# EAGLE board pandaLight (EAGLE 6.6.0), part 1 of 2
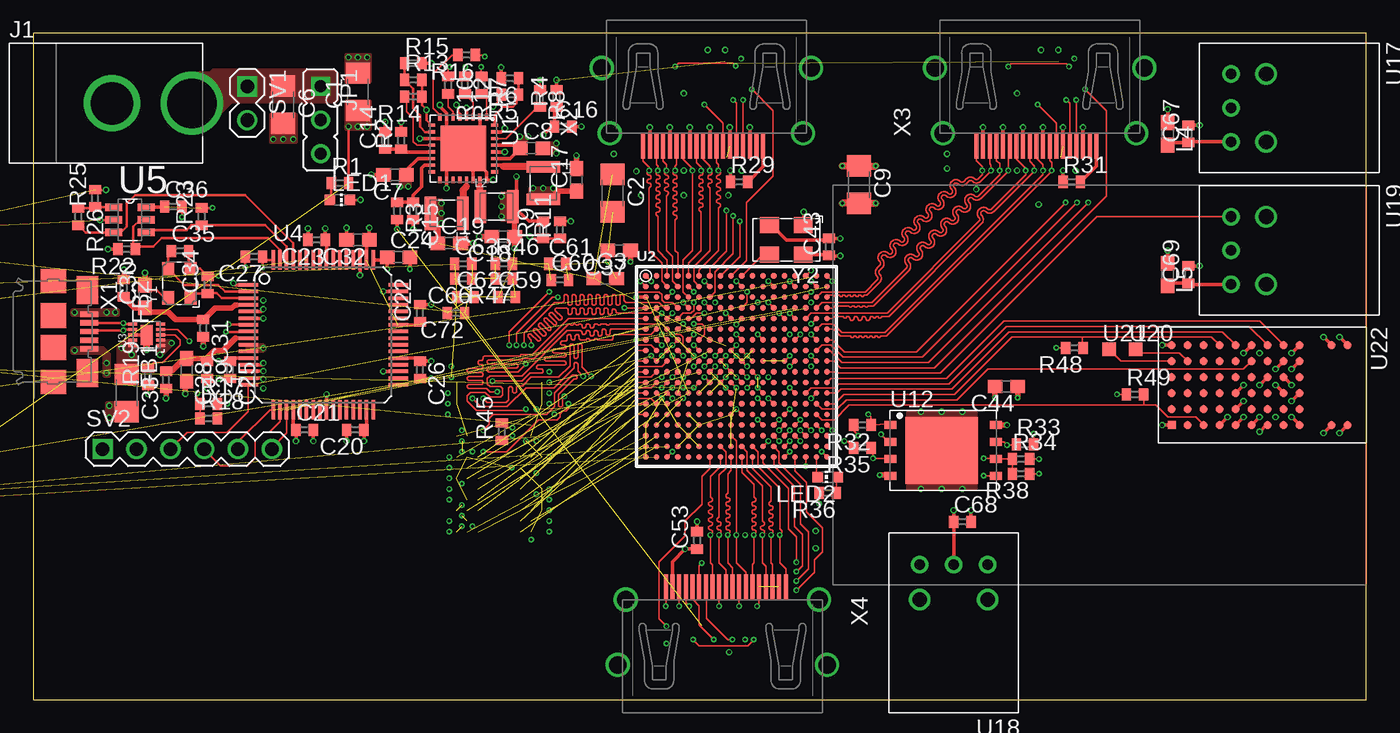
[diagram p9: board, top side]
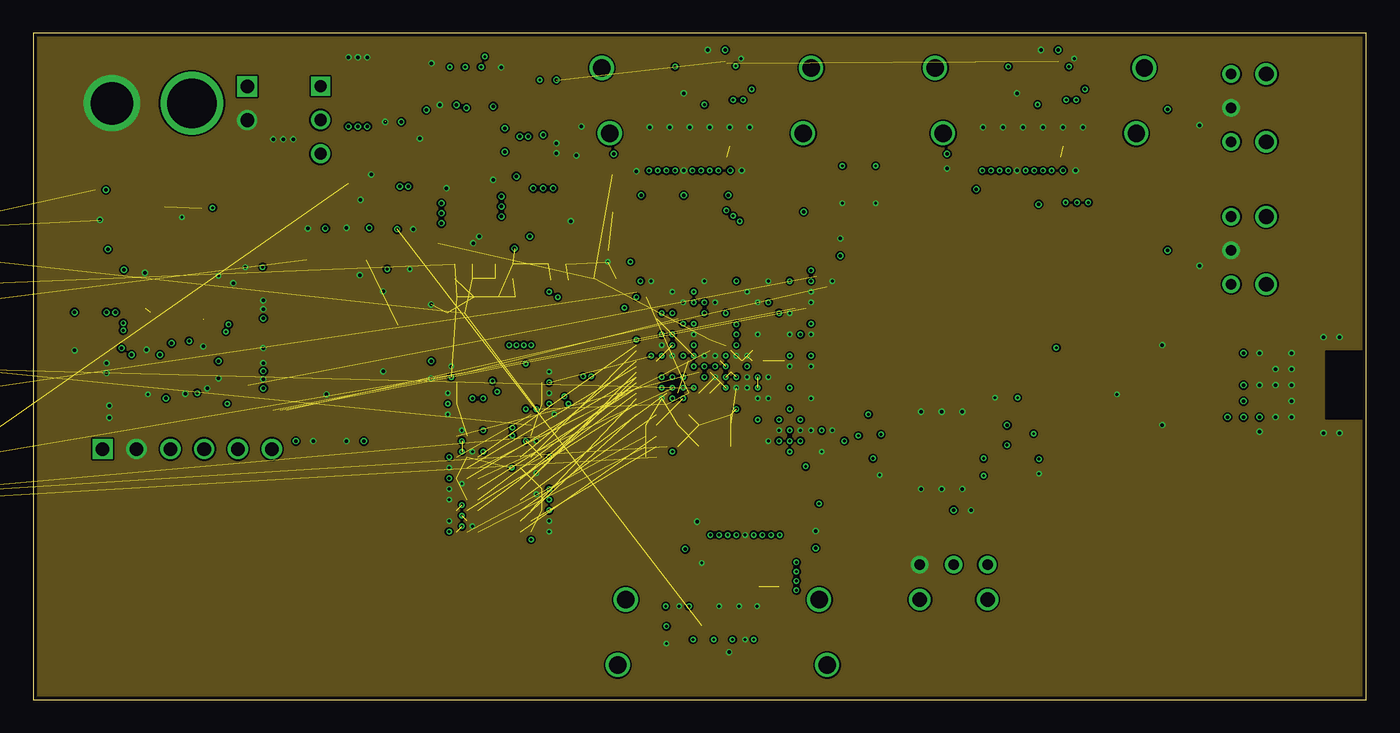
[diagram p10: board, inner layer Ground]
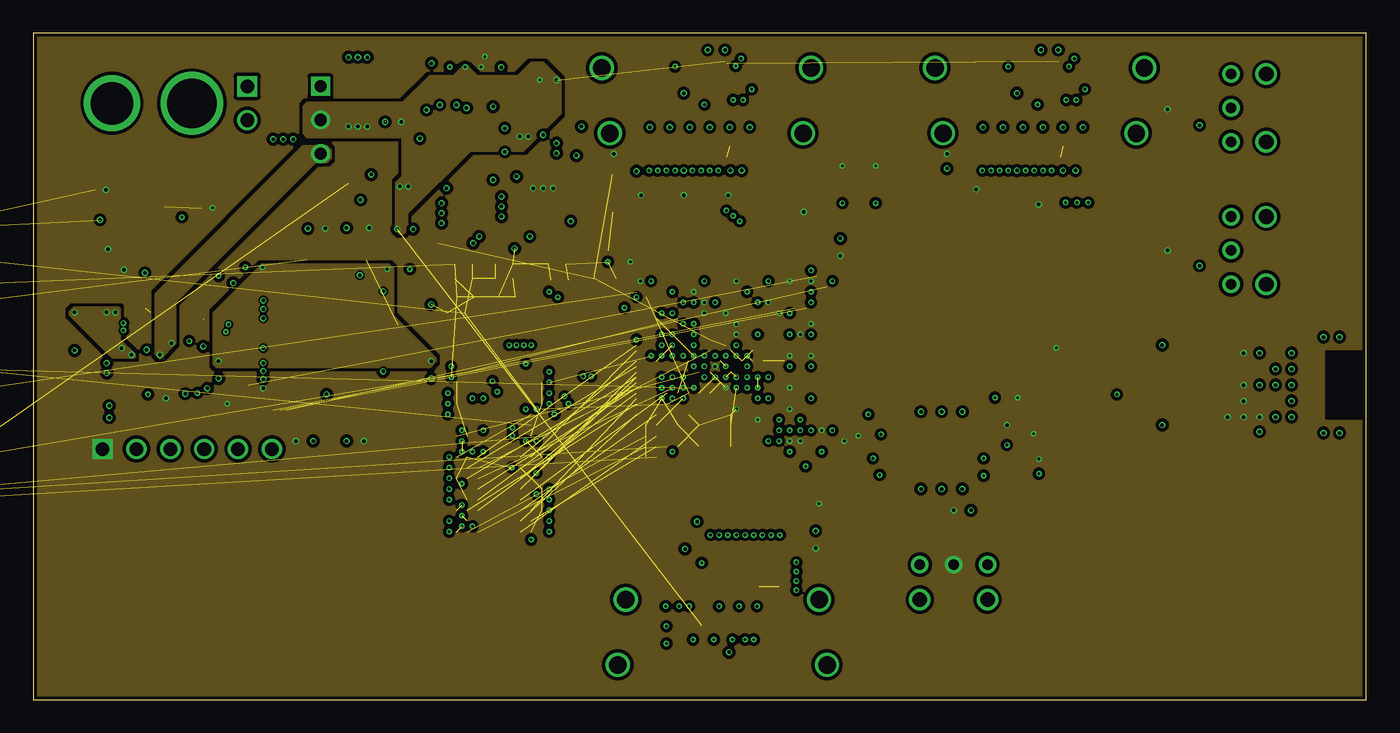
[diagram p11: board, inner layer Power]
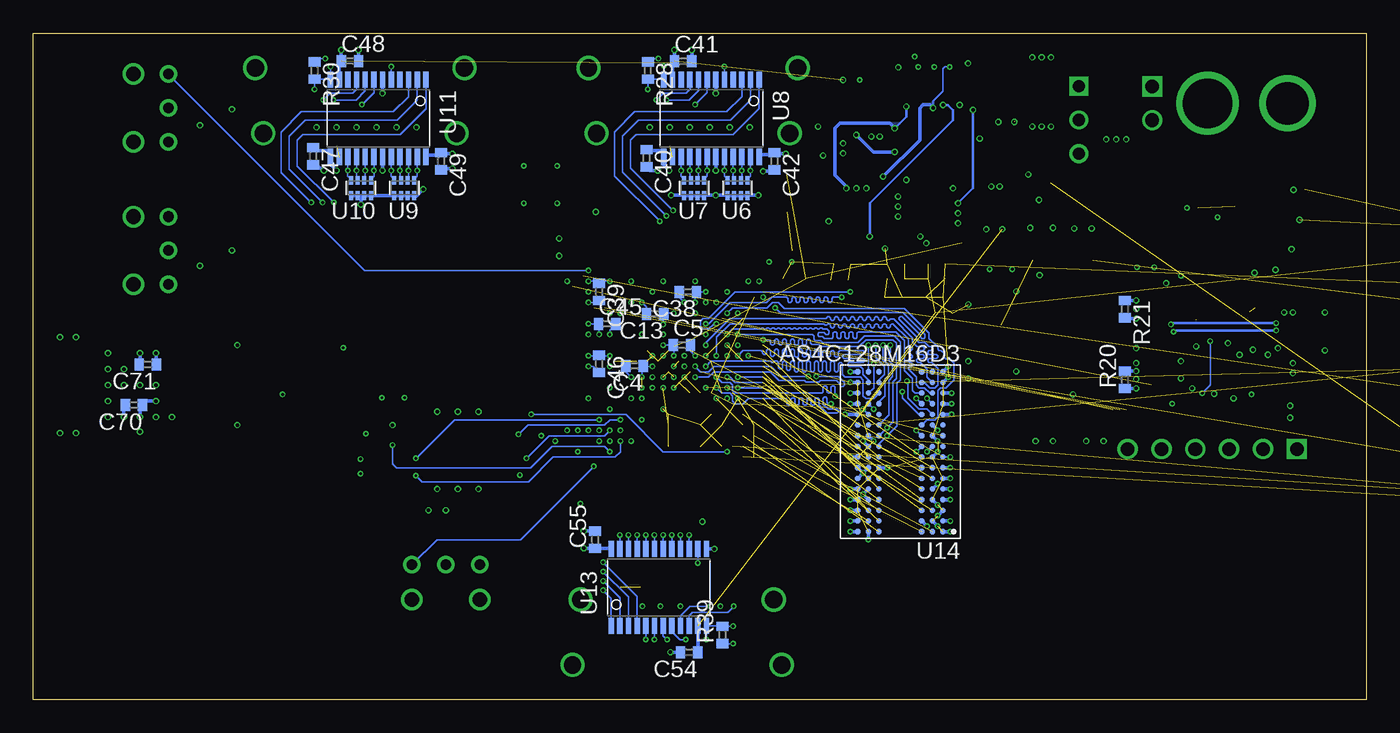
[diagram p12: board, bottom side, seen from below]

Size 100 x 50 mm. Coordinates in mm from the lower left corner, seen from the top.
Outline: 0,0 100,0 100,50 0,50 0,0
Copper layers (1*2+15*16): Top 0.035mm / dielectric 0.15mm / Ground 0.035mm / dielectric 1.16mm / Power 0.035mm / dielectric 0.15mm / Bottom 0.035mm
Design rules "rules *": minimum track width 5mil, minimum drill 8mil, track to track 5mil, track to pad 5mil, pad to pad 5mil, via to via 5mil, smd to smd 5mil, copper to edge 10mil, drill to drill 8mil, minimum pad ring 10mil, minimum via ring 4mil, stop-mask expansion 2mil, vias tented up to drill 100mil, thermal gap 10mil
Net classes: 1 power: width 0.127 mm, clearance 0.127 mm; 2 tmds: width 0.127 mm, clearance 0.127 mm; 3 ddr3_vref: width 0.127 mm, clearance 0.127 mm; 4 vbus: width 0.254 mm, clearance 0.127 mm

## Footprints (pad centres in the part's own frame; a part is rotated, then mirrored left to right if it is on the bottom)
1206 = smd 1.6 x 1.8: 1 -1.4,0; 2 1.4,0
0603 = smd 1.1 x 1: 1 -0.85,0; 2 0.85,0
0402 = smd 0.7 x 0.9: 1 -0.65,0; 2 0.65,0
PJ-037A = drill 3.2: BARREL 0,0 | drill 3.7: CENTER 6,0
JP2 = drill 0.914 square: 1 -2.54,0 | drill 0.914: 2 0,0; 3 2.54,0
1008 = smd 0.85 x 2.5: 1 -1.225,0; 2 1.225,0
LED-0603 = smd 0.8 x 0.8: A 0,-0.75; C 0,0.75
MA02-1 = drill 1.016 square: 1 -1.27,0 | drill 1.016: 2 1.27,0
MA06-1 = drill 1.016 square: 1 -6.35,0 | drill 1.016: 2 -3.81,0; 3 -1.27,0; 4 1.27,0; 5 3.81,0; 6 6.35,0
QFN-32-5X5 = smd 0.5 x 0.23: 1 -2.35,1.75; 2 -2.35,1.25; 3 -2.35,0.75; 4 -2.35,0.25; 5 -2.35,-0.25; 6 -2.35,-0.75; 7 -2.35,-1.25; 8 -2.35,-1.75; 17 2.35,-1.75; 18 2.35,-1.25; 19 2.35,-0.75; 20 2.35,-0.25; 21 2.35,0.25; 22 2.35,0.75; 23 2.35,1.25; 24 2.35,1.75 | smd 0.23 x 0.5: 9 -1.75,-2.35; 10 -1.25,-2.35; 11 -0.75,-2.35; 12 -0.25,-2.35; 13 0.25,-2.35; 14 0.75,-2.35; 15 1.25,-2.35; 16 1.75,-2.35; 25 1.75,2.35; 26 1.25,2.35; 27 0.75,2.35; 28 0.25,2.35; 29 -0.25,2.35; 30 -0.75,2.35; 31 -1.25,2.35; 32 -1.75,2.35 | smd 3.4 x 3.4: ETP 0,0
CS324 = smd 0.4 x 0.4: A1 -6.8,6.8; A2 -6,6.8; A3 -5.2,6.8; A4 -4.4,6.8; A5 -3.6,6.8; A6 -2.8,6.8; A7 -2,6.8; A8 -1.2,6.8; A9 -0.4,6.8; A10 0.4,6.8; A11 1.2,6.8; A12 2,6.8; A13 2.8,6.8; A14 3.6,6.8; A15 4.4,6.8; A16 5.2,6.8; A17 6,6.8; A18 6.8,6.8; B1 -6.8,6; B2 -6,6; B3 -5.2,6; B4 -4.4,6; B5 -3.6,6; B6 -2.8,6; B7 -2,6; B8 -1.2,6; B9 -0.4,6; B10 0.4,6; B11 1.2,6; B12 2,6; B13 2.8,6; B14 3.6,6; B15 4.4,6; B16 5.2,6; B17 6,6; B18 6.8,6; C1 -6.8,5.2; C2 -6,5.2; C3 -5.2,5.2; C4 -4.4,5.2; C5 -3.6,5.2; C6 -2.8,5.2; C7 -2,5.2; C8 -1.2,5.2; C9 -0.4,5.2; C10 0.4,5.2; C11 1.2,5.2; C12 2,5.2; C13 2.8,5.2; C14 3.6,5.2; C15 4.4,5.2; C16 5.2,5.2; C17 6,5.2; C18 6.8,5.2; D1 -6.8,4.4; D2 -6,4.4; D3 -5.2,4.4; D4 -4.4,4.4; D5 -3.6,4.4; D6 -2.8,4.4; D7 -2,4.4; D8 -1.2,4.4; D9 -0.4,4.4; D10 0.4,4.4; D11 1.2,4.4; D12 2,4.4; D13 2.8,4.4; D14 3.6,4.4; D15 4.4,4.4; D16 5.2,4.4; D17 6,4.4; D18 6.8,4.4; E1 -6.8,3.6; E2 -6,3.6; E3 -5.2,3.6; E4 -4.4,3.6; E5 -3.6,3.6; E6 -2.8,3.6; E7 -2,3.6; E8 -1.2,3.6; E9 -0.4,3.6; E10 0.4,3.6; E11 1.2,3.6; E12 2,3.6; E13 2.8,3.6; E14 3.6,3.6; E15 4.4,3.6; E16 5.2,3.6; E17 6,3.6; E18 6.8,3.6; F1 -6.8,2.8; F2 -6,2.8; F3 -5.2,2.8; F4 -4.4,2.8; F5 -3.6,2.8; F6 -2.8,2.8; F7 -2,2.8; F8 -1.2,2.8; F9 -0.4,2.8; F10 0.4,2.8; F11 1.2,2.8; F12 2,2.8; F13 2.8,2.8; F14 3.6,2.8; F15 4.4,2.8; F16 5.2,2.8; F17 6,2.8; F18 6.8,2.8; G1 -6.8,2; G2 -6,2; G3 -5.2,2; G4 -4.4,2; G5 -3.6,2; G6 -2.8,2; G7 -2,2; G8 -1.2,2; G9 -0.4,2; G10 0.4,2; G11 1.2,2; G12 2,2; G13 2.8,2; G14 3.6,2; G15 4.4,2; G16 5.2,2; G17 6,2; G18 6.8,2; H1 -6.8,1.2; H2 -6,1.2; H3 -5.2,1.2; H4 -4.4,1.2; H5 -3.6,1.2; H6 -2.8,1.2; H7 -2,1.2; H8 -1.2,1.2; H9 -0.4,1.2; H10 0.4,1.2; H11 1.2,1.2; H12 2,1.2; H13 2.8,1.2; H14 3.6,1.2; H15 4.4,1.2; H16 5.2,1.2; H17 6,1.2; H18 6.8,1.2; J1 -6.8,0.4; J2 -6,0.4; J3 -5.2,0.4; J4 -4.4,0.4; J5 -3.6,0.4; J6 -2.8,0.4; J7 -2,0.4; J8 -1.2,0.4; J9 -0.4,0.4; J10 0.4,0.4; J11 1.2,0.4; J12 2,0.4; J13 2.8,0.4; J14 3.6,0.4; J15 4.4,0.4; J16 5.2,0.4; J17 6,0.4; J18 6.8,0.4; K1 -6.8,-0.4; K2 -6,-0.4; K3 -5.2,-0.4; K4 -4.4,-0.4; K5 -3.6,-0.4; K6 -2.8,-0.4; K7 -2,-0.4; K8 -1.2,-0.4; K9 -0.4,-0.4; K10 0.4,-0.4; K11 1.2,-0.4; K12 2,-0.4; K13 2.8,-0.4; K14 3.6,-0.4; K15 4.4,-0.4; K16 5.2,-0.4; K17 6,-0.4; K18 6.8,-0.4; L1 -6.8,-1.2; L2 -6,-1.2; L3 -5.2,-1.2; L4 -4.4,-1.2; L5 -3.6,-1.2; L6 -2.8,-1.2; L7 -2,-1.2; L8 -1.2,-1.2; L9 -0.4,-1.2; L10 0.4,-1.2; L11 1.2,-1.2; L12 2,-1.2; L13 2.8,-1.2; L14 3.6,-1.2; L15 4.4,-1.2; L16 5.2,-1.2; L17 6,-1.2; L18 6.8,-1.2; M1 -6.8,-2; M2 -6,-2; M3 -5.2,-2; M4 -4.4,-2; M5 -3.6,-2; M6 -2.8,-2; M7 -2,-2; M8 -1.2,-2; M9 -0.4,-2; M10 0.4,-2; M11 1.2,-2; M12 2,-2; M13 2.8,-2; M14 3.6,-2; M15 4.4,-2; M16 5.2,-2; M17 6,-2; M18 6.8,-2; N1 -6.8,-2.8; N2 -6,-2.8; N3 -5.2,-2.8; N4 -4.4,-2.8; N5 -3.6,-2.8; N6 -2.8,-2.8; N7 -2,-2.8; N8 -1.2,-2.8; N9 -0.4,-2.8; N10 0.4,-2.8; N11 1.2,-2.8; N12 2,-2.8; N13 2.8,-2.8; N14 3.6,-2.8; N15 4.4,-2.8; N16 5.2,-2.8; N17 6,-2.8; N18 6.8,-2.8; P1 -6.8,-3.6; P2 -6,-3.6; P3 -5.2,-3.6; P4 -4.4,-3.6; P5 -3.6,-3.6; P6 -2.8,-3.6; P7 -2,-3.6; P8 -1.2,-3.6; P9 -0.4,-3.6; P10 0.4,-3.6; P11 1.2,-3.6; P12 2,-3.6; P13 2.8,-3.6; P14 3.6,-3.6; P15 4.4,-3.6; P16 5.2,-3.6; P17 6,-3.6; P18 6.8,-3.6; R1 -6.8,-4.4; R2 -6,-4.4; R3 -5.2,-4.4; R4 -4.4,-4.4; R5 -3.6,-4.4; R6 -2.8,-4.4; R7 -2,-4.4; R8 -1.2,-4.4; R9 -0.4,-4.4; R10 0.4,-4.4; R11 1.2,-4.4; R12 2,-4.4; R13 2.8,-4.4; R14 3.6,-4.4; R15 4.4,-4.4; R16 5.2,-4.4; R17 6,-4.4; R18 6.8,-4.4; T1 -6.8,-5.2; T2 -6,-5.2; T3 -5.2,-5.2; T4 -4.4,-5.2; T5 -3.6,-5.2; T6 -2.8,-5.2; T7 -2,-5.2; T8 -1.2,-5.2; T9 -0.4,-5.2; T10 0.4,-5.2; T11 1.2,-5.2; T12 2,-5.2; T13 2.8,-5.2; T14 3.6,-5.2; T15 4.4,-5.2; T16 5.2,-5.2; T17 6,-5.2; T18 6.8,-5.2; U1 -6.8,-6; U2 -6,-6; U3 -5.2,-6; U4 -4.4,-6; U5 -3.6,-6; U6 -2.8,-6; U7 -2,-6; U8 -1.2,-6; U9 -0.4,-6; U10 0.4,-6; U11 1.2,-6; U12 2,-6; U13 2.8,-6; U14 3.6,-6; U15 4.4,-6; U16 5.2,-6; U17 6,-6; U18 6.8,-6; V1 -6.8,-6.8; V2 -6,-6.8; V3 -5.2,-6.8; V4 -4.4,-6.8; V5 -3.6,-6.8; V6 -2.8,-6.8; V7 -2,-6.8; V8 -1.2,-6.8; V9 -0.4,-6.8; V10 0.4,-6.8; V11 1.2,-6.8; V12 2,-6.8; V13 2.8,-6.8; V14 3.6,-6.8; V15 4.4,-6.8; V16 5.2,-6.8; V17 6,-6.8; V18 6.8,-6.8
SON10 = smd 0.23 x 0.7: 1 -0.8,-1.05; 2 -0.4,-1.05; 3 0,-1.05; 4 0.4,-1.05; 5 0.8,-1.05; 6 0.8,1.05; 7 0.4,1.05; 8 0,1.05; 9 -0.4,1.05; 10 -0.8,1.05 | smd 1.5 x 0.9: ETP 0,0
LQFP64 = smd 1.45 x 0.27: 1 -5.625,3.75; 2 -5.625,3.25; 3 -5.625,2.75; 4 -5.625,2.25; 5 -5.625,1.75; 6 -5.625,1.25; 7 -5.625,0.75; 8 -5.625,0.25; 9 -5.625,-0.25; 10 -5.625,-0.75; 11 -5.625,-1.25; 12 -5.625,-1.75; 13 -5.625,-2.25; 14 -5.625,-2.75; 15 -5.625,-3.25; 16 -5.625,-3.75; 33 5.625,-3.75; 34 5.625,-3.25; 35 5.625,-2.75; 36 5.625,-2.25; 37 5.625,-1.75; 38 5.625,-1.25; 39 5.625,-0.75; 40 5.625,-0.25; 41 5.625,0.25; 42 5.625,0.75; 43 5.625,1.25; 44 5.625,1.75; 45 5.625,2.25; 46 5.625,2.75; 47 5.625,3.25; 48 5.625,3.75 | smd 0.27 x 1.45: 17 -3.75,-5.625; 18 -3.25,-5.625; 19 -2.75,-5.625; 20 -2.25,-5.625; 21 -1.75,-5.625; 22 -1.25,-5.625; 23 -0.75,-5.625; 24 -0.25,-5.625; 25 0.25,-5.625; 26 0.75,-5.625; 27 1.25,-5.625; 28 1.75,-5.625; 29 2.25,-5.625; 30 2.75,-5.625; 31 3.25,-5.625; 32 3.75,-5.625; 49 3.75,5.625; 50 3.25,5.625; 51 2.75,5.625; 52 2.25,5.625; 53 1.75,5.625; 54 1.25,5.625; 55 0.75,5.625; 56 0.25,5.625; 57 -0.25,5.625; 58 -0.75,5.625; 59 -1.25,5.625; 60 -1.75,5.625; 61 -2.25,5.625; 62 -2.75,5.625; 63 -3.25,5.625; 64 -3.75,5.625
SOT23-6 = smd 1.27 x 0.559: 1 -1.219,0.94; 2 -1.219,0; 3 -1.219,-0.94; 4 1.219,-0.94; 5 1.219,0; 6 1.219,0.94
741C083 = smd 0.3 x 0.65: 1 -0.75,-0.575; 2 -0.25,-0.575; 3 0.25,-0.575; 4 0.75,-0.575; 5 0.75,0.575; 6 0.25,0.575; 7 -0.25,0.575; 8 -0.75,0.575
PW_R-PDSO-G24 = smd 1.2 x 0.4: 1 -2.9,3.575; 2 -2.9,2.925; 3 -2.9,2.275; 4 -2.9,1.625; 5 -2.9,0.975; 6 -2.9,0.325; 7 -2.9,-0.325; 8 -2.9,-0.975; 9 -2.9,-1.625; 10 -2.9,-2.275; 11 -2.9,-2.925; 12 -2.9,-3.575; 13 2.9,-3.575; 14 2.9,-2.925; 15 2.9,-2.275; 16 2.9,-1.625; 17 2.9,-0.975; 18 2.9,-0.325; 19 2.9,0.325; 20 2.9,0.975; 21 2.9,1.625; 22 2.9,2.275; 23 2.9,2.925; 24 2.9,3.575
V-PDFN-8_8X6 = smd 0.9 x 0.6: 1 -3.85,1.9; 2 -3.85,0.63; 3 -3.85,-0.64; 4 -3.85,-1.91; 5 4.05,-1.9; 6 4.05,-0.63; 7 4.05,0.64; 8 4.05,1.91 | smd 5.41 x 5.05: ETP 0,0
96-FBGA_13X9 = smd 0.4 x 0.4: A1 -3.2,6; A2 -2.4,6; A3 -1.6,6; A7 1.6,6; A8 2.4,6; A9 3.2,6; B1 -3.2,5.2; B2 -2.4,5.2; B3 -1.6,5.2; B7 1.6,5.2; B8 2.4,5.2; B9 3.2,5.2; C1 -3.2,4.4; C2 -2.4,4.4; C3 -1.6,4.4; C7 1.6,4.4; C8 2.4,4.4; C9 3.2,4.4; D1 -3.2,3.6; D2 -2.4,3.6; D3 -1.6,3.6; D7 1.6,3.6; D8 2.4,3.6; D9 3.2,3.6; E1 -3.2,2.8; E2 -2.4,2.8; E3 -1.6,2.8; E7 1.6,2.8; E8 2.4,2.8; E9 3.2,2.8; F1 -3.2,2; F2 -2.4,2; F3 -1.6,2; F7 1.6,2; F8 2.4,2; F9 3.2,2; G1 -3.2,1.2; G2 -2.4,1.2; G3 -1.6,1.2; G7 1.6,1.2; G8 2.4,1.2; G9 3.2,1.2; H1 -3.2,0.4; H2 -2.4,0.4; H3 -1.6,0.4; H7 1.6,0.4; H8 2.4,0.4; H9 3.2,0.4; J1 -3.2,-0.4; J2 -2.4,-0.4; J3 -1.6,-0.4; J7 1.6,-0.4; J8 2.4,-0.4; J9 3.2,-0.4; K1 -3.2,-1.2; K2 -2.4,-1.2; K3 -1.6,-1.2; K7 1.6,-1.2; K8 2.4,-1.2; K9 3.2,-1.2; L1 -3.2,-2; L2 -2.4,-2; L3 -1.6,-2; L7 1.6,-2; L8 2.4,-2; L9 3.2,-2; M1 -3.2,-2.8; M2 -2.4,-2.8; M3 -1.6,-2.8; M7 1.6,-2.8; M8 2.4,-2.8; M9 3.2,-2.8; N1 -3.2,-3.6; N2 -2.4,-3.6; N3 -1.6,-3.6; N7 1.6,-3.6; N8 2.4,-3.6; N9 3.2,-3.6; P1 -3.2,-4.4; P2 -2.4,-4.4; P3 -1.6,-4.4; P7 1.6,-4.4; P8 2.4,-4.4; P9 3.2,-4.4; R1 -3.2,-5.2; R2 -2.4,-5.2; R3 -1.6,-5.2; R7 1.6,-5.2; R8 2.4,-5.2; R9 3.2,-5.2; T1 -3.2,-6; T2 -2.4,-6; T3 -1.6,-6; T7 1.6,-6; T8 2.4,-6; T9 3.2,-6
PMOD-2X6 = drill 1.016 square: 1 6.35,1.27 | drill 1.016: 2 3.81,1.27; 3 1.27,1.27; 4 -1.27,1.27; 5 -3.81,1.27; 6 -6.35,1.27; 7 6.35,-1.27; 8 3.81,-1.27; 9 1.27,-1.27; 10 -1.27,-1.27; 11 -3.81,-1.27; 12 -6.35,-1.27
PLR135-T10_PLT133-T10W = drill 0.8: 1 2.54,-2.63; 2 0,-2.63; 3 -2.54,-2.63 | drill 1.1: NC1 2.54,0; NC2 -2.54,0
TP10SQ = smd 1 x 1: TP 0,0
PAN1322 = smd 0.6 x 0.6: A1 3,-6.6; A2 3,-5.4; A3 3,-4.2; A4 3,-3; A5 3,-1.8; A6 3,-0.6; A7 3,0.6; A8 3,1.8; A9 3,3; A11 3,5.4; A12 3,6.6; B1 1.8,-6.6; B2 1.8,-5.4; B3 1.8,-4.2; B4 1.8,-3; B5 1.8,-1.8; B6 1.8,-0.6; B7 1.8,0.6; B8 1.8,1.8; B9 1.8,3; C1 0.6,-6.6; C2 0.6,-5.4; C3 0.6,-4.2; C4 0.6,-3; C5 0.6,-1.8; C6 0.6,-0.6; C7 0.6,0.6; C8 0.6,1.8; C9 0.6,3; D1 -0.6,-6.6; D2 -0.6,-5.4; D3 -0.6,-4.2; D4 -0.6,-3; D5 -0.6,-1.8; D6 -0.6,-0.6; D7 -0.6,0.6; D8 -0.6,1.8; D9 -0.6,3; E1 -1.8,-6.6; E2 -1.8,-5.4; E3 -1.8,-4.2; E4 -1.8,-3; E5 -1.8,-1.8; E6 -1.8,-0.6; E7 -1.8,0.6; E8 -1.8,1.8; E9 -1.8,3; F1 -3,-6.6; F2 -3,-5.4; F3 -3,-4.2; F4 -3,-3; F5 -3,-1.8; F6 -3,-0.6; F7 -3,0.6; F8 -3,1.8; F9 -3,3; F11 -3,5.4; F12 -3,6.6
USB-UB-S = smd 0.4 x 1.35: D+ 0,2.675; D- -0.65,2.675; GND 1.3,2.675; ID 0.65,2.675; VBUS -1.3,2.675 | smd 1.8 x 1.9: SH0 -3.8,0; SH3 3.8,0 | smd 1.9 x 1.9: SH1 -1.2,0; SH2 1.2,0 | smd 2.1 x 1.6: SH4 3.1,2.55; SH5 -3.1,2.55
HDMI_TYPE_A_RECEPTICAL = smd 1.9 x 0.3: 1 -3.95,4.5; 2 -3.95,4; 3 -3.95,3.5; 4 -3.95,3; 5 -3.95,2.5; 6 -3.95,2; 7 -3.95,1.5; 8 -3.95,1; 9 -3.95,0.5; 10 -3.95,0; 11 -3.95,-0.5; 12 -3.95,-1; 13 -3.95,-1.5; 14 -3.95,-2; 15 -3.95,-2.5; 16 -3.95,-3; 17 -3.95,-3.5; 18 -3.95,-4; 19 -3.95,-4.5 | drill 1.3: SHIELD0 -3,7; SHIELD1 1.9,7.6; SHIELD2 -3,-7.5; SHIELD3 1.9,-8.1
403-3.2X2.5 = smd 1 x 0.9: 1 -1.1,-0.8; 2 1.1,-0.8; 3 1.1,0.9; 4 -1.1,0.9
636 = smd 1.4 x 1.2: 1 -1.27,-1.1; 2 1.27,-1.1; 3 1.27,1.1; 4 -1.27,1.1

## Placement (x,y rotation side)
C1  100u  [1206]  24.35,45.6 90 top
C2  100u  [1206]  43.45,38 270 top
C3  4.7u  [0603]  42.9,31.6 0 top
C4  0.47u  [0402]  54.9,25.05 180 bottom
C5  0.47u  [0402]  51.35,26.6 0 bottom
C6  100u  [1206]  18.75,44.65 270 top
C7  4.7u  [0603]  27.12,39.38 180 top
C8  4.7u  [0603]  37.38,41.38 0 top
C9  100u  [1206]  61.95,38.65 270 top
C10  4.7u  [0603]  -70.79,35.37 0 top  (outside the outline)
C11  0.47u  [0402]  -77.14,30.29 0 top  (outside the outline)
C12  0.47u  [0402]  -7.78,35.37 0 top  (outside the outline)
C13  0.47u  [0402]  53.35,28.95 180 bottom
C14  0.1u  [0402]  26.4,41.95 90 top
C15  0.1u  [0402]  28.5,36.67 270 top
C16  0.1u  [0402]  39.75,43 0 top
C17  4.7u  [0603]  40.75,39 90 top
C18  4.7u  [0603]  35.25,34.75 180 top
C19  4.7u  [0603]  31.2,34.25 0 top
C20  0.1u  [0402]  24.15,20.25 180 top
C21  0.1u  [0402]  20.35,20.25 0 top
C22  0.1u  [0402]  29,29 90 top
C23  0.1u  [0402]  21.25,34.5 180 top
C24  4.7u  [0603]  27.4,33.2 0 top
C25  0.1u  [0402]  14.75,24.75 270 top
C26  0.1u  [0402]  29,24.75 270 top
C27  0.1u  [0402]  16.55,33.25 180 top
C28  4.7u  [0603]  11.5,24.75 270 top
C29  0.1u  [0402]  13.05,24.75 270 top
C30  4.7u  [0603]  8.38,30.25 90 top
C31  0.1u  [0402]  12.75,27.88 270 top
C32  4.7u  [0603]  24.35,34.5 180 top
C33  100u  [1206]  7,23 270 top
C34  27p  [0402]  13.07,31.12 90 top
C35  27p  [0402]  11,33.67 0 top
C36  0.1u  [0402]  10.5,37 0 top
C37  4.7u  [0603]  43.95,33.7 180 top
C38  0.47u  [0402]  50.9,30.6 180 bottom
C39  0.47u  [0402]  57.55,30.6 270 bottom
C40  0.1u  [0402]  54,40.62 270 bottom
C41  0.1u  [0402]  51.25,47.9 0 bottom
C42  0.1u  [0402]  44.4,40.4 270 bottom
C43  0.1u  [0402]  59.7,33.98 90 top
C44  4.7u  [0603]  73,23.5 180 top
C45  0.47u  [0402]  56.95,28.2 0 bottom
C46  0.47u  [0402]  57.55,25.2 270 bottom
C47  0.1u  [0402]  79,40.77 270 bottom
C48  0.1u  [0402]  76.25,47.92 0 bottom
C49  0.1u  [0402]  69.4,40.4 270 bottom
C50  4.7u  [0603]  -60.63,35.37 0 top  (outside the outline)
C51  0.47u  [0402]  -64.44,30.29 0 top  (outside the outline)
C52  0.47u  [0402]  -70.79,30.29 0 top  (outside the outline)
C53  0.1u  [0402]  49.8,11.95 90 top
C54  0.1u  [0402]  50.8,3.55 180 bottom
C55  0.1u  [0402]  57.85,12 90 bottom
C56  4.7u  [0603]  -35.23,35.37 0 top  (outside the outline)
C57  0.47u  [0402]  -26.34,30.29 0 top  (outside the outline)
C58  0.47u  [0402]  -32.69,30.29 0 top  (outside the outline)
C59  1u  [0402]  35.5,30.2 0 top
C60  1u  [0402]  39.5,31.5 0 top
C61  0.1u  [0402]  39.3,32.7 0 top
C62  0.1u  [0402]  32.4,30.2 0 top
C63  0.1u  [0402]  32.25,32.7 0 top
C64  0.1u  [0402]  -25.07,35.37 0 top  (outside the outline)
C65  0.1u  [0402]  -30.15,35.37 0 top  (outside the outline)
C66  0.1u  [0402]  32.25,31.6 180 top
C67  0.1u  [0402]  86.65,42.45 90 top
C68  0.1u  [0402]  69.7,13.35 0 top
C69  0.1u  [0402]  86.65,31.9 90 top
C70  0.1u  [0402]  92.45,22.1 180 bottom
C71  0.1u  [0402]  91.4,25.15 180 bottom
C72  0.1u  [0402]  31.7,29 180 top
FB1  1A  [0402]  9.95,24 90 top
FB2  1A  [0402]  6.78,30.88 270 top
J1  PJ-037A  [PJ-037A]  5.9,44.75 0 top
JP1  5V_SEL  [JP2]  21.55,43.5 270 top
JP2  PMOD0-1_VCC_SEL  [JP2]  -33.25,1.55 270 top  (outside the outline)
JP3  PMOD2-3_VCC_SEL  [JP2]  -36.5,1.55 270 top  (outside the outline)
L1  1u, 3A  [1008]  38.25,38.75 270 top
L2  1u, 3A  [1008]  34.75,37 0 top
L3  1u, 3A  [1008]  31,36.5 180 top
L4  47u  [0603]  85.1,42.45 270 top
L5  47u  [0603]  85.1,31.9 270 top
LED1  Green  [LED-0603]  23,37.5 270 top
LED2  Yellow  [LED-0603]  59.6,16.7 90 top
R1  1k  [0402]  23,38.75 0 top
R2  51  [0402]  27.6,41.95 90 top
R3  51  [0402]  27.3,36.67 270 top
R4  51  [0402]  39.25,45.12 90 top
R5  309k  [0402]  35.75,45.4 180 top
R6  71.5k  [0402]  35.75,46.62 180 top
R7  100k  [0402]  33.62,46.1 270 top
R8  100k  [0402]  38,45.12 270 top
R9  316k  [0402]  38.25,35.25 90 top
R10  100k  [0402]  31.12,46.1 270 top
R11  221k  [0402]  39.5,35.25 90 top
R12  100k  [0402]  32.38,46.1 270 top
R13  274k  [0402]  28.5,46.5 0 top
R14  100k  [0402]  28.5,45.25 180 top
R15  294k  [0402]  28.5,47.75 0 top
R16  100k  [0402]  32.5,48.38 180 top
R17  10k  [0402]  13.15,22.2 0 top
R18  1k  [0402]  13.15,21.1 0 top
R19  10k  [0402]  8.6,24.23 90 top
R20  10k  [0402]  18.1,24 90 bottom
R21  12k  [0402]  18.1,29.3 270 bottom
R22  10k  [0402]  7,33.79 180 top
R23  10k  [0402]  12.62,36.25 90 top
R24  10k  [0402]  -80.95,20.13 0 top  (outside the outline)
R25  10k  [0402]  4.62,37.62 90 top
R26  2.2k  [0402]  3.38,36.25 270 top
R27  1k  [0402]  -25.07,20.13 0 top  (outside the outline)
R28  10k  [0402]  53.9,47.2 270 bottom
R29  1k  [0402]  52.95,38.85 0 top
R30  10k  [0402]  78.9,47.2 270 bottom
R31  1k  [0402]  77.9,38.85 0 top
R32  2.4k  [0402]  62.2,20.6 180 top
R33  10k  [0402]  74.4,19.15 0 top
R34  100  [0402]  74.1,18.05 0 top
R35  10k  [0402]  62.2,18.9 180 top
R36  1k  [0402]  59.6,15.5 180 top
R37  4.7k  [0402]  -49.2,12.51 0 top  (outside the outline)
R38  100  [0402]  74.1,16.95 180 top
R39  10k  [0402]  48.3,4.85 90 bottom
R40  4.7k  [0402]  -54.28,12.51 0 top  (outside the outline)
R41  120  [0402]  -19.99,25.21 0 top  (outside the outline)
R42  4.7k  [0402]  -44.12,12.51 0 top  (outside the outline)
R43  4.7k  [0402]  -39.04,12.51 0 top  (outside the outline)
R44  240  [0402]  -9.83,25.21 0 top  (outside the outline)
R45  100  [0402]  35.15,20.1 90 top
R46  1k  [0402]  35.3,32.7 0 top
R47  1k  [0402]  35.3,31.6 180 top
R48  10k  [0402]  78.1,26.4 180 top
R49  10k  [0402]  82.65,22.9 0 top
SV1  EXT_SUP  [MA02-1]  16.05,44.75 270 top
SV2  JTAG  [MA06-1]  11.55,18.8 0 top
U1  MIC23450AAAYML  [QFN-32-5X5]  32.25,41.35 270 top
U2  6SLX45CSG324  [CS324]  52.75,25 0 top
U3  TPD4S014SON  [SON10]  8.5,27.38 90 top
U4  FT2232HL  [LQFP64]  21.75,27.38 0 top
U5  93LC46BT-I/OT  [SOT23-6]  7.25,36 0 top
U6  51  [741C083]  47.17,38.4 180 bottom
U7  51  [741C083]  50.42,38.4 180 bottom
U8  TPD12S016PWR  [PW_R-PDSO-G24]  49.12,43.62 270 bottom
U9  51  [741C083]  72.17,38.4 180 bottom
U10  51  [741C083]  75.42,38.4 180 bottom
U11  TPD12S016PWR  [PW_R-PDSO-G24]  74.12,43.62 270 bottom
U12  N25Q128AF8  [V-PDFN-8_8X6]  68.15,18.7 0 top
U13  TPD12S016PWR  [PW_R-PDSO-G24]  53.08,8.43 90 bottom
U14  AS4C128M16D3  [96-FBGA_13X9]  34.95,18.6 180 bottom
U15  PMOD-2X6  [PMOD-2X6]  -23.45,2.8 0 top  (outside the outline)
U16  PMOD-2X6  [PMOD-2X6]  -46.31,2.8 0 top  (outside the outline)
U17  PLR135-T10  [PLR135-T10_PLT133-T10W]  92.5,44.4 270 top
U18  PLT133-T10W  [PLR135-T10_PLT133-T10W]  69.05,7.5 180 top
U19  PLR135-T10  [PLR135-T10_PLT133-T10W]  92.5,33.7 270 top
U20  TP10SQ  [TP10SQ]  82.7,26.3 0 top
U21  TP10SQ  [TP10SQ]  80.7,26.3 0 top
U22  PAN1322  [PAN1322]  92,23.6 270 top
X1  USBUB-S  [USB-UB-S]  1.5,27.62 270 top
X2  HDMI_RECEPTICAL_A  [HDMI_TYPE_A_RECEPTICAL]  50.25,45.5 90 top
X3  HDMI_RECEPTICAL_A  [HDMI_TYPE_A_RECEPTICAL]  75.25,45.5 90 top
X4  HDMI_RECEPTICAL_A  [HDMI_TYPE_A_RECEPTICAL]  51.95,4.5 270 top
Y1  403  [403-3.2X2.5]  11,31.25 90 top
Y2  20Mhz  [636]  56.5,34.5 180 top

## Tracks (layer width: path | path; a pad name or v marks a point on that pad's centre or on a via)
+1V2  (via drill 0.2, 0.25)  (11 unrouted)
  Top 0.127: U2.M12 v54.35,23.4 | U2.L10 v52.75,24.2 | U2.K9 v51.95,25 | U2.L8 v51.95,24.2 | U2.K11 v54.35,24.2 | U2.H9 v52.75,26.6 | U2.J8 v51.95,25.8 | U2.J10 v53.55,25
  Top 0.203: U1.9 29.5,43.5 v29.5,44.25 29.15,44.6 R14.1 R13.2
  Top 0.406: v30.62,35.75 30.35,35.48 C19.1
  Bottom 0.127: v51.95,25.8 51.95,26.55 C5.1 v52.75,26.6 | v54.35,24.2 54.35,24.95 C4.1 54.2,25 v53.55,25
  Bottom 0.203: v29.5,44.25 29.5,38.38 v30.62,37.25
  other vias: 30.62,36.5
  pour Top (no thermals): 30,35.5 30,37.5 30.62,37.5 30.62,35.5
+1V5  (via drill 0.2, 0.25)  (33 unrouted)
  Top 0.127: R10.1 31.12,47.35 v31.25,47.48 | U2.G4 v47.95,26.6 | U2.J5 v49.55,25.8 | U2.E2 v47.15,29 | U2.M4 v48.75,22.6 | U2.J2 v46.35,25.8
  Top 0.254: U1.4 v32.5,44.4 | R9.2 37.2,35.9 L2.2 36.25,37.27 v36.25,39.25
  Top 0.406: L2.2 36.1,36.88 C18.1 v36.1,33.85
  Bottom 0.127: v31.25,47.48 31.62,47.48 31.75,47.35 31.75,45.65 32.5,44.9 v32.5,44.4
  Bottom 0.254: v32.5,44.4 32.75,44.65 33.25,44.65 33.5,44.4 33.5,42 v36.25,39.25 | U14.R1 v31.35,24.2 | U14.N1 v31.1,22.2 | U14.K2 v32.15,19.4 | U14.H2 v32.15,18.6 | U14.F1 v31.2,16.6 | U14.D2 v32.15,14.6 | U14.C1 v32.15,13.8 | U14.B2 v32.15,13 | U14.A1 v31.2,12.6 | U14.A8 v37.35,12 | U14.C9 v38.7,14.2 | U14.D9 v38.7,15 | U14.E9 v38.7,15.8 | U14.G7 v35.9,17.4 | U14.H9 v38.7,18.2 | U14.K8 v36.95,19.4 | U14.N9 v38.7,22.2 | U14.R9 v38.7,23.8
  other vias: 35.12,36.25 35.12,37 35.12,37.75
  pour Top (no thermals): 35.12,36 35.12,38 35.75,38 35.75,36
  pour Bottom (no thermals): 32.45,44.95 32.75,44.65 32.45,44.35
+1V5_VREF  (via drill 0.2)  (11 unrouted)
  Top 0.254: U2.C1 v45.25,30.2
  Bottom 0.127: U14.M8 v37.75,21.8 | U14.H1 v31.2,18.2
+1V8  (via drill 0.2, 0.25)
  Top 0.203: U4.64 17.45,33 C27.1 v17.2,32.45
  Top 0.254: v26.55,32.3 C24.1 26.45,33 U4.49 | v29.85,25.4 C26.1 28.77,25.62 U4.37 | U4.12 14.97,25.62 C25.1 v13.9,25.4
  pour Power (no thermals): 13.55,25.2 13.55,29 17.15,32.6 26.65,32.6 26.95,32.3 26.95,28.8 30.15,25.6 30.15,25.4 29.75,25 13.75,25
+3V3  (via drill 0.2, 0.25)  (21 unrouted)
  Top 0.127: R16.1 33.75,48.38 v33.88,48.25 | v33.6,47.48 33.6,46.77 R7.1 | U2.B17 v58.35,31.4 | U2.B15 v56.75,31.4 | U2.D13 v55.15,29.8 | R17.2 v14.55,22.2 | U2.B5 v49.55,30.6 | U2.D7 v50.35,29.8 | U2.B1 v45.55,31.4 | U2.E17 v58.35,28.2 | U2.G15 v57.55,27.4 | U2.J17 v58.35,25.8 | U2.E14 v55.95,29 | U2.J14 v56.75,25.8 | U2.B10 v52.75,31.4 | U2.E9 v51.95,29 | R48.2 v76.75,26.4 | U2.R17 v59.15,20.2 | U2.T15 v57.55,19.4 | U2.U14 v56.75,19.4 | U2.P14 v56.75,21.8 | U2.R12 v54.35,21 | U2.P10 v52.75,21.8 | U2.M15 v56.75,23.4 | U2.K7 v51.15,25 | U2.M9 v51.95,23.4 | R33.2 v75.05,19.95 | R34.2 v75.45,18.05 | R36.2 v58.95,14.7 | v60.85,19.4 61.05,19.4 R35.2 | R32.2 61.55,20.15 v61.9,19.8 | U2.E10 53.15,28.55 v52.75,28.15 | U2.G10 v52.75,27.4 | U2.E5 49.35,28.6 49.75,29 v50.35,29
  Top 0.203: R7.1 33.73,46.62 | R5.2 35.1,45.1 v34.5,44.5 | R23.2 v13.45,36.9 | v5.45,38.25 4.65,38.25 R25.2
  Top 0.254: U4.42 28.77,28.12 C22.1 | U4.56 22,34.4 C23.1 v21.9,35.35 | Y2.4 59.62,33.4 C43.1 59.73,33.3 v60.55,33.3 | v35.38,42.88 35.1,42.6 U1.31 | U5.6 9.79,36.94 C36.1 | R22.2 v5.61,33.79 v5.6,33.8 | U4.50 25,34.7 C32.1 v25.2,35.4 | v57.8,36.6 57.8,35.63 Y2.1 | v24.8,19.4 C20.1 25,20.45 U4.31 | v19.7,19.4 C21.1 19.5,20.45 U4.20 | L4.1 v85.1,44.3 | L5.1 v85.1,33.7 | U22.B5 v90.8,22.4 | U22.C5 v90.8,23.6 | U22.A4 v89.6,21.2 | U22.A5 v90.8,21.2 | U22.A6 v92,21.2 | U22.F6 v90.8,26 | U18.2 C68.1 v69.05,14.2
  Top 0.406: C17.1 39.23,38.15 v39,38.38 | v6.8,32.25 6.8,31.55 FB2.1 | FB1.1 v9.95,22.6 | C37.1 v44.8,32.85 | C44.1 v73.85,22.65 | U12.8 v73.05,20.6
  Top 0.508: v60.7,40.05 C9.1 v63.2,40.05
  Bottom 0.127: v49.55,30.6 C38.1 50.35,30.5 v50.35,29.8 | v56.75,31.4 57.4,31.4 C39.1 57.7,31.4 v58.35,31.4 | v57.55,27.4 57.55,28.15 C45.1 v58.35,28.2 | v56.75,25.8 57.5,25.8 C46.1 57.6,25.8 v58.35,25.8 | v51.95,29 52.65,29 C13.1 | v52.75,28.15 52.75,28.95 52.7,29
  Bottom 0.203: v34.5,44.5 34.5,43.75 v35.38,42.88
  Bottom 0.254: v35.38,42.88 35.75,43.25 39.5,43.25 39.88,42.88 39.88,39.38 39,38.5 v39,38.38 | R20.1 v17.25,23.35 | v90.8,26 90.8,25.25 C71.1 | v90.8,22.4 91.5,22.4 C70.1 92,21.9 v92,21.2 | U13.24 56.67,11.35 C55.1 v58.7,11.35 | v68.55,40.95 69.3,40.95 | 69.3,40.95 C49.1 | U11.24 70.55,40.85 69.4,40.85 69.3,40.95 | v43.55,40.95 44.3,40.95 C42.1 44.55,40.9 45.55,40.9 U8.24 | v45.6,37.85 46.4,37.85 U6.8 U6.7 U6.6 U6.5 47.95,37.85 49.65,37.85 U7.8 U7.7 U7.6 U7.5 51.2,37.85 v52.15,37.85 | U9.8 U9.7 U9.6 U9.5 U10.8 U10.7 75.4,37.83 | 75.4,37.83 U10.6 U10.5 | v75.42,37.15 75.42,37.8 75.4,37.83 | v70.75,38.3 71.25,37.8 71.4,37.8
  other vias: 38.25,38.38 37.5,38.38 48.8,37.85
  pour Power (isolate 0.254, rank 4, no thermals): 0,50 100,50 100,0 0,0
  pour Top (no thermals): 39.25,38.38 37.25,38.38 37.25,37.75 39.25,37.75
  pour Bottom (no thermals): 35.75,43.25 35,43.25 35.38,42.88
+5V  (via drill 0.2, 0.25)  (5 unrouted)
  Top 0.127: R8.1 v38,46.5 | v32.4,47.48 32.4,46.77 R12.1
  Top 0.203: R1.2 v23.65,43
  Top 0.254: U1.27 35.75,40.6 C8.1 36.3,41.6 U1.29 | U1.14 28.85,40.6 27.98,39.73 C7.1 | R4.2 v39.25,46.5 | v27.6,43.35 R2.2 | R3.2 v27.3,35.3
  Bottom 0.254: C54.1 U13.11 | U8.11 52.05,47.75 C41.1 v51.9,48.75 | U11.11 77.05,47.77 C48.1 v76.9,48.75
  other vias: 25.05,43 24.35,43 36.5,42.25 37.12,42.25 27.5,38.5 28.12,38.5
  pour Power (isolate 0.254, rank 2, no thermals): 20.55,44.75 27.75,44.75 29.75,46.75 31.52,46.75 32.27,47.5 32.52,47.5 33.27,46.75 36.38,46.75 37.38,47.75 38.25,47.75 39.5,46.5 39.5,44 36.75,41.25 32.75,41.25 28,36.5 28,35.25 27.75,35 27.5,35 27.25,35.25 27.25,38.75 27.75,39.25 27.75,42.25 20.55,42.25 20.3,42.5 20.3,44.5
  pour Top (no thermals): 23.45,44.9 25.25,44.9 25.25,42.8 23.45,42.8
  pour Top (no thermals): 36.38,41.75 36.38,42.25 37.12,42.25 37.12,42.12 36.75,41.75
  pour Top (no thermals): 27.5,38.5 28.25,38.5 28.25,39 27.5,39
BT_CTS
  Top 0.127: U22.F5 89.2,27.6 73.2,27.6 68.9,23.3 60.6,23.3 60.3,23 U2.M18
BT_RESET#
  Top 0.127: U2.P17 59.15,21 60.1,21 61.2,22.1 83.3,22.1 | 83.3,22.1 84.2,22.1 85.1,21.2 87.2,21.2 U22.A3 | 83.3,22.1 R49.2
BT_RTS
  Top 0.127: U22.F8 92,28.4 72.8,28.4 68.5,24.1 59.85,24.1 U2.L18
BT_RX
  Top 0.127: U2.N17 59.15,21.8 60.3,21.8 61,22.5 69.3,22.5 71.6,24.8 90.77,24.8 U22.E6
BT_TX
  Top 0.127: U22.F7 91.2,28 73,28 68.7,23.7 60.4,23.7 60.1,23.4 58.35,23.4 U2.M16
BT_WAKE
  Top 0.127: 88.97,26.57 U22.F4 88.38,27.2 78.7,27.2 | U2.N18 60.1,22.2 60.8,22.9 69.1,22.9 73.4,27.2 78.7,27.2 | 78.7,27.2 78.7,26.45 R48.1
CENTER
  pour Top (isolate 0.254, no thermals): 14,44 14.88,44.88 22.68,44.88 22.8,45 22.8,47 22.55,47.25 13.5,47.25 13.25,47 11.75,47 11.75,46.75 12.75,46.75 14,45.5
DDR3_A0  (via drill 0.2)
  Top 0.127: U2.J7 v50.35,25 | v33.75,22.6 34.05,22.3 35.45,22.3 35.65,22.5 35.65,23.4 35.75,23.5 35.85,23.5 35.95,23.4 35.95,23.1 36.05,23 36.15,23 36.25,23.1 36.25,23.45 36.35,23.55 36.7,23.55 37.35,24.2 39.4,24.2 40.25,25.05 40.25,26.6 40.35,26.7 40.45,26.7 40.55,26.6 40.55,25.7 40.65,25.6 40.75,25.6 40.85,25.7 40.85,26.6 40.95,26.7 41.05,26.7 41.15,26.6 41.15,24.95 v41.85,24.25
  Bottom 0.127: v50.35,25 49.95,24.6 49.35,24.6 48.95,25 44.65,25 43.9,24.25 v41.85,24.25 | v33.75,22.6 U14.N3
DDR3_A1  (via drill 0.2)
  Top 0.127: U2.J6 v49.55,25
  Bottom 0.127: v49.55,25 49.15,25.4 44.7,25.4 44.6,25.3 44.5,25.3 44.4,25.4 44.2,25.4 44.1,25.3 44.1,24.9 44,24.8 43.9,24.8 43.8,24.9 43.8,25.3 43.7,25.4 43.6,25.4 43.5,25.3 43.5,24.8 43.4,24.7 43.3,24.7 43.2,24.8 43.2,25.3 43.1,25.4 43,25.4 42.9,25.3 42.9,24.7 42.8,24.6 42.7,24.6 42.6,24.7 42.6,25.3 42.5,25.4 42.4,25.4 42.3,25.3 42.3,24.7 42.2,24.6 42.1,24.6 42,24.7 42,25.3 41.9,25.4 41.8,25.4 41.7,25.3 41.7,24.7 41.6,24.6 41.5,24.6 41.4,24.7 41.4,25.3 41.3,25.4 41.2,25.4 41.1,25.3 41.1,24.7 41,24.6 40.9,24.6 40.8,24.7 40.8,25.3 40.7,25.4 40.6,25.4 40.5,25.3 40.5,24.7 40.4,24.6 40.3,24.6 40.2,24.7 40.2,25.3 40.1,25.4 40,25.4 39.9,25.3 39.9,24.7 39.8,24.6 39.7,24.6 39.6,24.7 39.6,25.2 39.5,25.3 39.4,25.3 39.3,25.2 39.3,24.4 39.1,24.2 37.95,24.2 37.75,24 37.75,22.8 37.55,22.6 36.95,22.6 U14.P7
DDR3_A2  (via drill 0.2)
  Top 0.127: U2.H5 48.75,26.6 48.75,27.2 48.55,27.4 v47.95,27.4
  Bottom 0.127: U14.P3 33.85,23 34.05,23.2 34.05,24.1 34.65,24.7 34.65,26.95 35.3,27.6 38.1,27.6 38.2,27.5 38.2,27.2 38.3,27.1 38.4,27.1 38.5,27.2 38.5,27.5 38.6,27.6 38.7,27.6 38.8,27.5 38.8,27.2 38.9,27.1 39,27.1 39.1,27.2 39.1,27.5 39.2,27.6 39.3,27.6 39.4,27.5 39.4,27.2 39.5,27.1 39.6,27.1 39.7,27.2 39.7,27.5 39.8,27.6 39.9,27.6 40,27.5 40,27.2 40.1,27.1 40.65,27.1 40.8,27.25 41.05,27.25 41.15,27.35 41.15,27.45 41.05,27.55 40.7,27.55 40.55,27.4 40.4,27.4 40.3,27.5 40.3,27.65 40.45,27.8 40.75,27.8 40.85,27.9 40.95,27.9 41.05,27.8 41.15,27.8 41.25,27.9 41.35,27.9 41.45,27.8 41.55,27.8 41.65,27.9 41.75,27.9 41.85,27.8 41.95,27.8 42.05,27.9 42.15,27.9 42.25,27.8 42.35,27.8 42.45,27.9 42.55,27.9 42.65,27.8 42.75,27.8 42.85,27.9 42.95,27.9 43.05,27.8 43.15,27.8 43.25,27.9 43.35,27.9 43.45,27.8 43.55,27.8 43.65,27.9 43.75,27.9 43.85,27.8 43.95,27.8 44.05,27.9 44.15,27.9 44.25,27.8 44.35,27.8 44.45,27.9 44.55,27.9 44.65,27.8 44.75,27.8 44.85,27.9 44.95,27.9 45.05,27.8 45.15,27.8 45.25,27.9 45.35,27.9 45.45,27.8 47.55,27.8 v47.95,27.4
DDR3_A3  (via drill 0.2)
  Top 0.127: U2.L7 v50.35,24.2 | v32.95,22.6 33.55,22 35.55,22 36.95,23.4 39.05,23.4 40.55,24.9 40.55,25.2 40.65,25.3 40.75,25.3 40.85,25.2 40.85,24.65 v41.25,24.25
  Bottom 0.127: v50.35,24.2 49.35,24.2 48.95,24.6 44.7,24.6 44.05,23.95 42.15,23.95 42.05,23.85 41.05,23.85 40.95,23.95 39.75,23.95 39.5,23.7 39.5,23.6 39.4,23.5 39.25,23.5 39.15,23.6 39.15,23.8 39.6,24.25 v41.25,24.25 | U14.N2 v32.95,22.6
DDR3_A4  (via drill 0.2)
  Top 0.127: U2.F3 47.15,28.2 43.25,28.2 43.15,28.1 43.05,28.1 42.95,28.2 42.6,28.2 42.5,28.1 42.4,28.1 42.3,28.2 42.15,28.2 42.05,28.1 42.05,28 41.95,27.9 41.85,27.9 41.75,28 41.75,28.1 41.65,28.2 41.55,28.2 41.45,28.1 41.45,28 41.35,27.9 41.25,27.9 41.15,28 41.15,28.1 41.05,28.2 40.95,28.2 40.85,28.1 40.75,28.1 40.65,28.2 40.55,28.2 40.45,28.1 40.35,28.1 40.25,28.2 40.15,28.2 37.55,25.6 36.75,25.6 36.65,25.5 34.15,25.5 34.05,25.4 34.05,25.3 34.15,25.2 36.25,25.2 36.35,25.1 36.35,25 36.25,24.9 34.15,24.9 34.05,24.8 34.05,24.7 34.15,24.6 36.35,24.6 v36.95,25.2
  Bottom 0.127: v36.95,25.2 36.95,23.4 U14.P8
DDR3_A5  (via drill 0.2)
  Top 0.127: v48.75,25.8 U2.H4
  Bottom 0.127: U14.P2 32.75,23 33.15,23.4 33.55,23.4 33.75,23.6 33.75,24.2 34.35,24.8 34.35,24.9 34.25,25 34.15,25 34.05,25.1 34.05,25.2 34.15,25.3 34.25,25.3 34.35,25.4 34.35,25.5 34.25,25.6 34.15,25.6 34.05,25.7 34.05,25.8 34.15,25.9 34.25,25.9 34.35,26 34.35,26.1 34.25,26.2 34.15,26.2 34.05,26.3 34.05,26.4 34.15,26.5 34.25,26.5 34.35,26.6 34.35,27.05 35.5,28.2 35.6,28.2 35.7,28.1 35.7,28 35.8,27.9 35.9,27.9 36,28 36,28.1 36.1,28.2 36.2,28.2 36.3,28.1 36.3,28 36.4,27.9 36.5,27.9 36.6,28 36.6,28.1 36.7,28.2 36.8,28.2 36.9,28.1 36.9,28 37,27.9 37.1,27.9 37.2,28 37.2,28.1 37.3,28.2 37.4,28.2 37.5,28.1 37.5,28 37.6,27.9 37.7,27.9 37.8,28 37.8,28.1 37.9,28.2 38,28.2 38.1,28.1 38.1,28 38.2,27.9 38.3,27.9 38.4,28 38.4,28.1 38.5,28.2 38.6,28.2 38.7,28.1 38.7,28 38.8,27.9 38.9,27.9 39,28 39,28.1 39.1,28.2 39.2,28.2 39.3,28.1 39.3,28 39.4,27.9 39.5,27.9 39.6,28 39.6,28.1 39.7,28.2 39.8,28.2 39.9,28.1 39.9,28 40,27.9 40.1,27.9 40.2,28 40.2,28.1 40.3,28.2 40.4,28.2 40.5,28.1 40.6,28.1 40.7,28.2 47.75,28.2 48.75,27.2 v48.75,25.8
DDR3_A6  (via drill 0.2)
  Top 0.127: U2.H3 v47.15,25.8
  Bottom 0.127: U14.R8 37.35,24 37.75,24.4 37.75,24.8 37.95,25 38.8,25 38.9,25.1 38.9,25.2 38.8,25.3 37.75,25.3 37.65,25.4 37.65,25.5 37.75,25.6 39.2,25.6 39.3,25.7 39.3,25.8 39.2,25.9 37.75,25.9 37.65,26 37.65,26.1 37.75,26.2 39.5,26.2 39.6,26.1 39.6,25.8 39.7,25.7 39.8,25.7 39.9,25.8 39.9,26.1 40,26.2 40.1,26.2 40.2,26.1 40.2,25.8 40.3,25.7 40.4,25.7 40.5,25.8 40.5,26.1 40.6,26.2 40.7,26.2 40.8,26.1 40.8,25.8 40.9,25.7 41,25.7 41.1,25.8 41.1,26.2 41.2,26.3 41.3,26.3 41.4,26.2 41.4,25.8 41.5,25.7 41.6,25.7 41.7,25.8 41.7,26.2 41.8,26.3 41.9,26.3 42,26.2 42,25.8 42.1,25.7 42.2,25.7 42.3,25.8 42.3,26.2 42.4,26.3 42.5,26.3 42.6,26.2 42.6,25.8 42.7,25.7 42.8,25.7 42.9,25.8 42.9,26.2 43,26.3 43.1,26.3 43.2,26.2 43.2,25.8 43.3,25.7 43.4,25.7 43.5,25.8 43.5,26.2 43.6,26.3 43.7,26.3 43.8,26.2 43.8,25.8 43.9,25.7 44,25.7 44.1,25.8 44.1,26.2 44.2,26.3 44.3,26.3 44.4,26.2 44.4,25.85 44.5,25.75 44.6,25.75 44.7,25.85 44.7,26.2 44.8,26.3 44.9,26.3 45,26.2 45,26 45.1,25.9 45.2,25.9 45.3,26 45.3,26.1 45.4,26.2 46.75,26.2 v47.15,25.8
DDR3_A7  (via drill 0.2)
  Top 0.127: U2.H6 v49.55,26.6
  Bottom 0.127: U14.R2 32.95,24.2 32.95,24.8 33.45,25.3 33.65,25.3 33.75,25.4 33.75,25.5 33.65,25.6 33.25,25.6 33.15,25.7 33.15,25.8 33.25,25.9 33.65,25.9 33.75,26 33.75,26.1 33.65,26.2 33.25,26.2 33.15,26.3 33.15,26.4 33.25,26.5 33.7,26.5 34.05,26.85 34.05,27.15 35.45,28.55 35.7,28.55 35.8,28.45 35.9,28.45 36,28.55 36,28.65 36.1,28.75 36.2,28.75 36.3,28.65 36.3,28.55 36.4,28.45 36.5,28.45 36.6,28.55 36.6,28.65 36.7,28.75 36.8,28.75 36.9,28.65 36.9,28.55 37,28.45 37.1,28.45 37.2,28.55 37.2,28.65 37.3,28.75 37.4,28.75 37.5,28.65 37.5,28.55 37.6,28.45 37.7,28.45 37.8,28.55 37.8,28.65 37.9,28.75 38,28.75 38.1,28.65 38.1,28.55 38.2,28.45 38.3,28.45 38.4,28.55 38.4,28.65 38.5,28.75 38.6,28.75 38.7,28.65 38.7,28.55 38.8,28.45 38.9,28.45 39,28.55 39,28.65 39.1,28.75 39.2,28.75 39.3,28.65 39.3,28.55 39.4,28.45 39.5,28.45 39.6,28.55 39.6,28.65 39.7,28.75 39.8,28.75 39.9,28.65 39.9,28.55 40,28.45 40.1,28.45 40.2,28.55 40.2,28.65 40.3,28.75 40.4,28.75 40.55,28.6 47.75,28.6 49.55,26.8 v49.55,26.6
DDR3_A8  (via drill 0.2)
  Top 0.127: U2.D2 46.35,29 43.8,29 43.7,29.1 43.7,29.2 43.6,29.3 43.5,29.3 43.4,29.2 43.4,29 43.3,28.9 43.2,28.9 43.1,29 43.1,29.3 43,29.4 42.9,29.4 42.8,29.3 42.8,29 42.7,28.9 42.6,28.9 42.5,29 42.5,29.3 42.4,29.4 42.3,29.4 42.2,29.3 42.2,29 42.1,28.9 42,28.9 41.9,29 41.9,29.3 41.8,29.4 41.7,29.4 41.6,29.3 41.6,29 41.5,28.9 41.4,28.9 41.3,29 41.3,29.3 41.2,29.4 41.1,29.4 41,29.3 41,29 40.9,28.9 40.8,28.9 40.7,29 40.7,29.3 40.6,29.4 40.5,29.4 40.4,29.3 40.4,29 40.3,28.9 40.2,28.9 40.1,29 40.1,29.3 40,29.4 39.25,29.4 39.15,29.3 39.15,29.2 39.65,28.7 39.65,28.6 39.55,28.5 39.45,28.5 38.9,29.05 38.8,29.05 38.7,28.95 38.7,28.85 39.25,28.3 39.25,28.2 39.15,28.1 39.05,28.1 38.5,28.65 38.4,28.65 38.3,28.55 38.3,28.45 38.85,27.9 38.85,27.8 38.75,27.7 38.65,27.7 38.1,28.25 38,28.25 37.9,28.15 37.9,28.05 38.45,27.5 38.45,27.4 38.35,27.3 38.25,27.3 37.7,27.85 37.6,27.85 37.5,27.75 37.5,27.65 38.05,27.1 38.05,27 37.95,26.9 37.85,26.9 37.3,27.45 37.2,27.45 37.1,27.35 37.1,27.25 37.35,27 v37.35,26.6
  Bottom 0.127: v37.35,26.6 U14.T8
DDR3_A9  (via drill 0.2)
  Top 0.127: U2.D1 v44.35,29.4
  Bottom 0.127: U14.R3 33.15,23.8 32.75,23.4 32.35,23.4 32.15,23.6 32.15,24.85 32.6,25.3 32.8,25.3 32.9,25.4 32.9,25.5 32.8,25.6 32.25,25.6 32.15,25.7 32.15,25.8 32.25,25.9 32.8,25.9 32.9,26 32.9,26.1 32.8,26.2 32.65,26.2 32.55,26.3 32.55,26.4 32.65,26.5 32.8,26.5 33.1,26.8 33.55,26.8 33.75,27 33.75,27.25 35.05,28.55 35.05,28.65 34.95,28.75 34.85,28.75 33.45,27.35 33.45,27.2 33.35,27.1 33.2,27.1 33.1,27.2 33.1,27.4 34.75,29.05 44,29.05 v44.35,29.4
DDR3_A10  (via drill 0.2)
  Top 0.127: U2.F4 v48.75,28.2 | v38.7,30.6 35.7,27.6 v35.7,26.6
  Bottom 0.127: U14.L7 35.8,21.35 35.8,23.95 35.55,24.25 35.55,25.2 35.8,25.45 35.8,25.6 35.7,25.7 35.7,25.8 35.8,25.9 35.8,26 35.7,26.1 v35.7,26.6 | v48.75,28.2 48.95,28.2 49.35,27.8 49.75,27.8 49.95,28 49.95,28.4 49.75,28.6 49.35,28.6 47.35,30.6 v38.7,30.6
DDR3_A11  (via drill 0.2)
  Top 0.127: v36.8,26.6 36.8,27.5 39.1,29.8 39.7,29.8 39.8,29.9 39.8,30.3 39.9,30.4 40,30.4 40.1,30.3 40.1,29.7 40.2,29.6 40.3,29.6 40.4,29.7 40.4,30.3 40.5,30.4 40.6,30.4 40.7,30.3 40.7,29.7 40.8,29.6 40.9,29.6 41,29.7 41,30.3 41.1,30.4 41.2,30.4 41.3,30.3 41.3,29.7 41.4,29.6 41.5,29.6 41.6,29.7 41.6,30.3 41.7,30.4 41.8,30.4 41.9,30.3 41.9,29.7 42,29.6 42.1,29.6 42.2,29.7 42.2,30.3 42.3,30.4 42.4,30.4 42.5,30.3 42.5,29.7 42.6,29.6 42.7,29.6 42.8,29.7 42.8,30.3 42.9,30.4 43,30.4 43.1,30.3 43.1,29.7 43.2,29.6 43.3,29.6 43.4,29.7 43.4,30.3 43.5,30.4 43.6,30.4 43.7,30.3 43.7,29.7 43.8,29.6 43.9,29.6 44,29.7 44,30.3 44.1,30.4 44.2,30.4 44.3,30.3 44.3,29.95 44.45,29.8 46.95,29.8 47.35,29.4 U2.D3
  Bottom 0.127: v36.8,26.6 36.8,25.65 36.15,25 36.15,24.4 36.55,24 U14.R7
DDR3_A12  (via drill 0.2)
  Top 0.127: U2.G6 50.35,27.4 50.35,28 50.15,28.2 v49.55,28.2 | v39.35,30.2 38.95,30.2 36.25,27.5 v36.25,26.6
  Bottom 0.127: U14.N7 36.55,22.35 36.1,22.8 36.1,24.05 35.85,24.3 35.85,25.1 36.25,25.5 v36.25,26.6 | v49.55,28.2 49.35,28.2 47.75,29.8 45,29.8 44.6,30.2 43.5,30.2 43.4,30.1 43.4,29.9 43.3,29.8 43.2,29.8 43.1,29.9 43.1,30.1 43,30.2 42.9,30.2 42.8,30.1 42.8,29.9 42.7,29.8 42.6,29.8 42.5,29.9 42.5,30.1 42.4,30.2 42.3,30.2 42.2,30.1 42.2,29.9 42.1,29.8 42,29.8 41.9,29.9 41.9,30.1 41.8,30.2 41.7,30.2 41.6,30.1 41.6,29.9 41.5,29.8 41.4,29.8 41.3,29.9 41.3,30.1 41.2,30.2 41.1,30.2 41,30.1 41,29.9 40.9,29.8 40.8,29.8 40.7,29.9 40.7,30.1 40.6,30.2 40.5,30.2 40.4,30.1 40.4,29.9 40.3,29.8 40.2,29.8 40.1,29.9 40.1,30.1 40,30.2 v39.35,30.2
DDR3_BA0  (via drill 0.2)
  Top 0.127: U2.F2 46.35,27.4 43.6,27.4 43.5,27.3 43.5,27.1 43.4,27 42.35,27 42.25,27.1 42.15,27.1 42.05,27 41.75,27 41.65,27.1 41.55,27.1 41.45,27 41.05,27 40.95,27.1 40.95,27.3 40.85,27.4 40.75,27.4 40.65,27.3 40.65,27.1 40.55,27 40.45,27 40.35,27.1 40.35,27.3 40.25,27.4 40.15,27.4 40.05,27.3 40.05,27 39.95,26.9 39.65,26.9 39.55,26.8 39.55,26.7 39.65,26.6 39.85,26.6 39.95,26.5 39.95,26.4 39.85,26.3 39.05,26.3 38.95,26.2 38.95,26.1 39.05,26 39.85,26 39.95,25.9 39.95,25.8 39.85,25.7 38.45,25.7 38.35,25.6 38.35,25.5 38.45,25.4 39.85,25.4 39.95,25.3 39.95,25.2 39.85,25.1 37.85,25.1 37.75,25 37.75,24.9 37.85,24.8 38.15,24.8 38.25,24.7 38.25,24.6 38.15,24.5 37.25,24.5 36.65,23.9 v34.45,23.9
  Bottom 0.127: U14.M2 32.95,21.8 33.55,21.8 34.4,22.65 34.4,23.85 v34.45,23.9
DDR3_BA1  (via drill 0.2)
  Top 0.127: U2.F1 43.35,27.8 43.25,27.7 43.25,27.45 43.15,27.35 43.05,27.35 42.95,27.45 42.95,27.7 42.85,27.8 42.75,27.8 42.65,27.7 42.65,27.4 42.55,27.3 42.45,27.3 42.35,27.4 42.35,27.6 42.25,27.7 42.15,27.7 42.05,27.6 42.05,27.4 41.95,27.3 41.85,27.3 41.75,27.4 41.75,27.6 41.65,27.7 41.55,27.7 41.45,27.6 41.45,27.5 41.35,27.4 41.25,27.4 41.15,27.5 41.15,27.6 41.05,27.7 40.05,27.7 36.65,24.3 34.25,24.3 34.05,24.1 34.05,23.7 34.25,23.5 35.05,23.5 35.2,23.35 35.2,22.85 35.05,22.7 34.25,22.7 33.9,23.05 32.8,23.05 32.55,22.8 32.55,22.4 33.25,21.7 36.85,21.7 v36.95,21.8
  Bottom 0.127: U14.N8 v36.95,21.8
DDR3_BA2  (via drill 0.2)
  Top 0.127: U2.E1 40.15,28.6 37.45,25.9 36.6,25.9 36.5,25.8 33.85,25.8 33.75,25.7 33.75,25.55 33.65,25.45 33.45,25.45 33.35,25.35 33.35,25.25 33.45,25.15 33.65,25.15 33.75,25.05 33.75,24.95 33.65,24.85 32.65,24.85 32.55,24.75 32.55,24.65 32.65,24.55 33.65,24.55 33.75,24.45 33.75,24.35 33.65,24.25 32.65,24.25 32.55,24.15 32.55,24.05 32.65,23.95 33.65,23.95 33.75,23.85 33.75,23.75 33.65,23.65 32.65,23.65 32.55,23.55 32.55,23.45 32.65,23.35 34,23.35 34.25,23.1 v34.8,23.1
  Bottom 0.127: U14.M3 33.55,21.4 34.8,22.65 v34.8,23.1
DDR3_CAS#  (via drill 0.2)
  Top 0.127: U2.K5 v48.75,24.2 | v33.75,20.2 34.2,20.65 34.2,21.1 34.5,21.4 38.5,21.4 39.1,22 39.1,23 40.45,24.35 40.7,24.35 40.8,24.25 40.8,24.15 40.7,24.05 40.55,24.05 39.4,22.9 39.4,22.05 39.5,21.95 39.6,21.95 39.7,22.05 39.7,22.6 v39.85,22.75
  Bottom 0.127: v48.75,24.2 48.35,23.8 47.75,23.8 47.55,23.6 47.55,23.2 47.35,23 40.85,23 40.75,23.1 40.75,23.45 40.65,23.55 40.55,23.55 40.45,23.45 40.45,23.1 40.35,23 40.25,23 40.15,23.1 40.15,23.45 40.05,23.55 39.95,23.55 39.85,23.45 v39.85,22.75 | U14.K3 v33.75,20.2
DDR3_CK  (via drill 0.2)
  Top 0.127: v47.15,27.4 U2.G3 | R45.1 35.5,19.8 v35.95,19.8
  Bottom 0.127: U14.J7 36.55,19.2 v35.95,19.8 35.2,20.55 35.2,23.75 34.95,24 34.95,26.85 35.4,27.3 37.65,27.3 38.15,26.8 40.8,26.8 40.95,26.95 41.35,26.95 41.45,27.05 41.45,27.3 41.55,27.4 v47.15,27.4
DDR3_CK#  (via drill 0.2)
  Top 0.127: v45.25,27 U2.G1 | R45.2 35.5,20.4 v35.95,20.4
  Bottom 0.127: U14.K7 v35.95,20.4 35.5,20.85 35.5,23.85 35.25,24.1 35.25,26.75 35.5,27 37.55,27 38.05,26.5 40.9,26.5 41.05,26.65 41.6,26.65 41.7,26.75 41.7,26.95 41.8,27.05 41.9,27.05 42,26.95 42,26.7 42.1,26.6 42.2,26.6 42.3,26.7 42.3,26.95 42.4,27.05 42.5,27.05 42.6,26.95 42.6,26.7 42.7,26.6 42.8,26.6 42.9,26.7 42.9,26.95 43,27.05 43.1,27.05 43.2,26.95 43.2,26.7 43.3,26.6 43.4,26.6 43.5,26.7 43.5,26.95 43.6,27.05 43.7,27.05 43.8,26.95 43.8,26.7 43.9,26.6 44,26.6 44.1,26.7 44.1,26.95 44.2,27.05 44.3,27.05 44.4,26.95 44.4,26.7 44.5,26.6 44.6,26.6 44.7,26.7 44.7,26.9 44.8,27 v45.25,27
DDR3_CKE  (2 unrouted)
DDR3_DQ0  (1 unrouted)
  Top 0.127: U2.L2 46.35,23.4 45.25,23.4
DDR3_DQ1  (1 unrouted)
  Top 0.127: U2.L1 45.25,23.8
DDR3_DQ2  (1 unrouted)
  Top 0.127: U2.K2 46.35,24.2 45.25,24.2
DDR3_DQ3  (1 unrouted)
  Top 0.127: U2.K1 45.25,24.6
DDR3_DQ4  (1 unrouted)
  Top 0.127: U2.H2 46.35,26.6 45.25,26.6
DDR3_DQ5  (1 unrouted)
  Top 0.127: U2.H1 45.25,26.2
DDR3_DQ6  (1 unrouted)
  Top 0.127: U2.J3 47.15,25 45.25,25
DDR3_DQ7  (1 unrouted)
  Top 0.127: U2.J1 45.25,25.4
DDR3_DQ8  (via drill 0.2)  (1 unrouted)
  Top 0.127: U2.M3 v47.95,22.6
DDR3_DQ9  (1 unrouted)
  Top 0.127: U2.M1 45.25,23
DDR3_DQ10  (1 unrouted)
  Top 0.127: U2.N2 46.35,22.6 45.25,22.6
DDR3_DQ11  (1 unrouted)
  Top 0.127: U2.N1 45.25,22.2
DDR3_DQ12  (1 unrouted)
DDR3_DQ13  (1 unrouted)
DDR3_DQ14  (1 unrouted)
DDR3_DQ15  (1 unrouted)
DDR3_LDM  (via drill 0.2)  (1 unrouted)
  Top 0.127: U2.K3 v47.15,24.2
  Bottom 0.127: v47.15,24.2 45.25,24.2
DDR3_LDQS  (via drill 0.2)  (1 unrouted)
  Top 0.127: U2.L4 v47.95,23.4
DDR3_LDQS#  (via drill 0.2)  (1 unrouted)
  Top 0.127: U2.L3 v47.15,23.4
  Bottom 0.127: v47.15,23.4 45.25,23.4
DDR3_ODT  (1 unrouted)
DDR3_RAS#  (via drill 0.2)
  Top 0.127: U2.L5 v48.75,23.4 | v33.75,18.6 35.5,18.6 37.9,21 39.3,21 39.5,21.2 39.5,21.45 39.7,21.65 39.95,21.65 40.15,21.85 v40.15,22.2
  Bottom 0.127: v48.75,23.4 48.35,23 47.75,23 47.55,22.8 47.55,22.4 47.35,22.2 46.75,22.2 46.35,22.6 43.55,22.6 43.45,22.5 43.45,22.2 43.35,22.1 43.25,22.1 43.15,22.2 43.15,22.55 43.05,22.65 42.95,22.65 42.85,22.55 42.85,22.2 42.75,22.1 42.65,22.1 42.55,22.2 42.55,22.55 42.45,22.65 42.35,22.65 42.25,22.55 42.25,22.2 42.15,22.1 42.05,22.1 41.95,22.2 41.95,22.55 41.85,22.65 41.75,22.65 41.65,22.55 41.65,22.2 41.55,22.1 41.45,22.1 41.35,22.2 41.35,22.55 41.25,22.65 41.15,22.65 41.05,22.55 41.05,22.1 40.45,21.5 39.7,21.5 39.6,21.6 39.6,21.7 39.7,21.8 40.35,21.8 40.75,22.2 40.75,22.6 40.65,22.7 40.55,22.7 40.45,22.6 40.45,22.3 40.35,22.2 v40.15,22.2 | U14.J3 v33.75,18.6
DDR3_RESET#  (via drill 0.2)  (2 unrouted)
  Top 0.127: U2.E4 48.75,29 49.35,29 49.55,29.2 v49.55,29.8
DDR3_UDM  (via drill 0.2)  (1 unrouted)
  Top 0.127: U2.K4 v47.95,24.2
  Bottom 0.127: 45.25,23.8 47.35,23.8 47.75,24.2 v47.95,24.2
DDR3_UDQS  (1 unrouted)
DDR3_UDQS#  (1 unrouted)
  Top 0.127: U2.P1 45.25,21.4
DDR3_WE#  (via drill 0.2)
  Top 0.127: U2.E3 v47.95,29
  Bottom 0.127: v47.95,29 47.55,29.4 44.95,29.4 44.55,29.8 44.1,29.8 43.65,29.35 34.65,29.35 32.8,27.5 32.8,27.1 32.15,26.45 32.15,26.3 32.05,26.2 31.9,26.2 31.7,26 31.7,25.7 31.55,25.55 31.25,25.55 30.95,25.25 30.95,24 31.55,23.4 31.95,23.4 32.15,23.2 32.15,21.2 32.35,21 32.95,21 U14.L3
FPGA_OSC1
  Top 0.127: Y2.3 54.75,33.4 U2.A10
GND  (via drill 0.2, 0.25)  (39 unrouted)
  Top 0.127: U2.B7 v50.35,31.4 | U2.E15 v56.75,29 | U2.B13 v55.15,31.4 | R19.1 v8.6,22.9 | U2.D5 v48.75,29.8 | U2.A1 v46.35,31.4 | U2.C16 v58.35,30.6 | U2.G17 v58.35,27.4 | U2.G12 v54.35,27.4 | U2.J15 v56.75,25 | R49.1 v81.3,22.9 | U2.R16 v58.35,20.2 | U2.T16 v57.55,20.2 | U2.R18 59.55,20.55 59.6,20.5 59.65,20.5 v59.95,20.2 | U2.R14 v55.95,20.2 | U2.N12 v54.35,22.6 | U2.N13 v55.15,22.6 | U2.M17 v58.35,22.6 | U2.K10 v53.55,24.2 | U2.L11 v53.55,23.4 | U2.K8 v51.15,24.2 | U2.L9 v52.75,23.4 | U2.H10 v53.55,25.8 | U2.H8 v51.15,25.8 | U2.U12 v55.15,19.4 | R38.1 v75.45,16.95 | U2.V18 v59.15,18.6 | U2.D10 53.55,29.8 v53.55,30.6 | U2.J9 v52.75,25.8 | X4.14 49.95,10.05 v50.15,10.25 | X4.8 v52.95,7 | X4.11 v51.45,7 | X4.5 54.45,7.15 v54.3,7 | X4.17 v48.45,7 | U2.A18 v59.95,31.4 | U2.G5 v49.55,27.4 | U2.G2 v47.15,26.6 | U2.J4 v47.95,25.8 | U2.C3 v47.95,30.6 | U2.M2 v47.15,22.6
  Top 0.203: C35.2 11.65,32.5 Y1.2 12.5,32.35 C34.2 13.88,31.77 v13.9,31.8 | Y1.4 9.85,30.15 9.25,30.75 8.72,30.75 C30.2 | C27.2 v15.9,32.45 | LED1.C v24.55,37.5 | C36.2 v11.15,36.2 | v5,36 U5.2 | R11.2 v40.33,35.9
  Top 0.254: U3.8 U3.ETP | U4.25 v22,22.9 | U4.47 v26.25,30.62 | U4.35 v26.25,24.62 | U4.1 15.12,31.12 v15,31.25 | Y2.2 55.4,35.6 56.5,34.5 59.58,34.5 C43.2 59.73,34.6 v60.55,34.6 | U1.ETP 33,40.6 U1.22 | U1.ETP 31.5,42.1 U1.11 v29,42.1 | U1.7 31,42.6 U1.ETP | U1.2 33.5,42.6 U1.ETP | U1.ETP 31,40.1 U1.18 v31,38.38 | U1.ETP 34,39.6 U1.24 v34.5,39 | v30.5,44.62 30.5,44.5 31,44 31,43.75 | C24.2 v28.25,32.3 | C32.2 v23.5,35.4 | U4.51 v24.5,31.85 | C16.2 v41.12,43 | R6.2 v35.1,47.45 | R15.2 v29.88,47.75 | 26.4,43.4 C14.2 | v25.35,39.4 26.25,39.4 C7.2 | v20.6,35.35 C23.2 | C22.2 v29.85,29.65 | C26.2 v29.85,24.1 | C20.2 v23.5,19.4 | C21.2 v21,19.4 | U4.5 17.07,29.12 v17.25,29.3 | U4.15 17.18,24.12 v17.25,24.05 | U4.13 17.12,25.12 v17.25,25.25 | C25.2 v13.9,24.1 | U22.D7 v92,23.6 | U22.A7 92.5,20.6 v92,20.1 | U22.A9 v94.4,21.2 | U22.C9 v94.4,22.4 | U22.F9 v94.4,26 | U22.E8 v93.2,24.8 | U22.E9 v94.4,24.8 | U22.D8 v94.4,23.6 | U22.C8 v93.2,23.6 | U22.A11 v96.8,20 | U22.A12 v98,20 | U22.F11 v96.8,27.2 | U22.F12 v98,27.2 | U22.F1 v84.7,26.6 | U22.A1 v84.7,20.6 | C53.2 v49.8,13.35 | C68.2 v70.35,14.2 | C15.2 v28.5,35.3 | X2.17 v53.75,42.95 | X2.14 v52.25,42.95 | X2.11 v50.75,42.95 | X2.8 v49.25,42.95 | X2.5 v47.75,42.95 | X2.2 v46.25,42.95 | X3.2 v71.25,42.95 | X3.5 v72.75,42.95 | X3.8 v74.25,42.95 | X3.11 v75.75,42.95 | X3.14 v77.25,42.95 | X3.17 v78.75,42.95 | C67.2 v87.5,43.1 | C69.2 v87.5,32.55
  Top 0.305: 19.25,42.75 C6.2
  Top 0.406: C30.2 v8.38,32.02 | v40.75,40.83 C17.2 | v12.75,26.5 C31.2 | C29.2 v13.05,23.35 | v11.4,22.95 11.4,23.8 C28.2 | C37.2 v43.1,32.85 | C44.2 v72.15,22.65 | U12.4 64.24,16.85 v63.5,16.85 | 32.4,34.3 C19.2 v33,34.25 | C18.2 v33.45,34.75
  Top 0.508: v8.5,26.25 U3.ETP | v60.7,37.25 C9.2 v63.2,37.25
  Bottom 0.127: C38.2 51.55,30.2 v51.15,29.8 | C39.2 57.7,29.8 v58.35,29.8 | C46.2 58,25 v58.35,25 | C45.2 56.75,27.75 v56.75,27.4 | 54,28.55 C13.2 54,29.45 v54.35,29.8 | C4.2 55.55,24.6 v55.15,24.2 | v50.15,10.25 U13.14 | U13.19 v53.4,12.35 | U13.6 v53.4,4.5 | R39.1 v47.5,4.2 | R28.1 53.65,48.1 v53.1,48.1 | R30.1 78.65,48.1 v78.1,48.1 | C5.2 50.7,26.15 v50.35,25.8
  Bottom 0.254: R21.1 v17.25,29.95 | v93.2,21.2 93.2,22 C70.2 | v92,26 92,25.2 C71.2 | C55.2 v58.7,12.65 | C54.2 v52.2,3.55 | C41.2 v50.6,48.75 | U8.6 v48.8,45.5 | C40.2 53.73,39.7 v53.15,39.7 | U8.19 v48.8,39.7 | C48.2 v75.6,48.75 | U11.19 v73.8,39.7 | U11.6 v73.8,45.5 | v78.2,39.7 78.3,39.7 78.72,40.12 C47.2 | v68.55,39.85 69.3,39.85 C49.2 | v45.25,39.65 44.5,39.65 C42.2 | U14.T1 v31.35,25 | U14.P1 v31.1,23 | U14.M1 v31.1,21.4 | U14.L2 v32.15,20.2 | U14.J2 v32.95,18.6 | U14.G1 v31.2,17.4 | U14.E2 v32.15,16.2 | U14.E1 v31.2,15.8 | U14.D1 v31.2,15 | U14.B1 v31.2,13.4 | U14.B3 v32.95,13 | U14.A9 v38.7,12.6 | U14.B9 v38.7,13.4 | U14.D8 v37.75,15.4 U14.E8 | U14.G8 v37.75,17 | v37.75,17 U14.G9 | U14.F9 v37.75,17 | U14.J8 v37.75,19.4 | U14.M9 v39.1,21.4 | U14.P9 v38.7,23 | U14.T9 v38.7,24.6
  other vias: 18,42.05 18.75,42.05 19.5,42.05 5.7,22.05 5.7,21.15 17.25,26.38 23.65,48.2 24.35,48.2 25.05,48.2 3.1,26.2 5.5,24.5 5.5,25.25 26.4,43.35 39.25,41 39.25,41.75 66.6,21.6 69.7,21.6 69.7,15.8 66.6,15.8 68.15,15.8 68.15,21.6
  pour Ground (no thermals): 0,50 100,50 100,0 0,0
  pour Top (no thermals): 17.8,43.9 19.7,43.9 19.7,41.85 17.8,41.85
  pour Top (isolate 0.254, no thermals): 5.5,20.95 7.6,20.95 7.6,22.25 5.5,22.25
  pour Top (no thermals): 23.45,48.4 25.25,48.4 25.25,46.35 23.45,46.35
  pour Top (no thermals): 2.9,26.4 2.9,26 5.1,26 5.3,25.8 5.3,24.3 5.7,24.3 5.7,25.95 5.25,26.4
  pour Top (no thermals): 38.75,41.75 39.25,41.75 39.25,41 38.75,41
  pour Top (no thermals): 16.05,26.6 17.25,26.6 17.35,26.5 17.35,26.25 17.25,26.15 16.05,26.15
  pour Top (no thermals): 65.6,21.6 70.7,21.6 70.7,15.8 65.6,15.8
HDMI_RX0_5V  (via drill 0.25)
  Top 0.254: R29.1 v52.3,39.7
  Bottom 0.254: v52.3,39.7 52.7,40.1 U8.13 52.7,41.2 54,41.2 C40.1
HDMI_RX0_CEC  (via drill 0.2)
  Top 0.127: X2.13 51.75,43.25 v50.35,44.65
  Bottom 0.127: U8.7 49.45,45.55 v50.35,44.65
HDMI_RX0_CEC_3V3  (via drill 0.2)
  Top 0.127: U2.A7 50.75,32.4 52,33.65 v52,36.7
  Bottom 0.127: U8.1 45.55,44.35 47.5,42.4 54.8,42.4 55.2,42 55.2,39.9 v52,36.7
HDMI_RX0_CLK_N  (via drill 0.2)
  Top 0.127: U2.A6 49.95,32.25 51.4,33.7 51.4,36.9 51.55,37.05 51.55,37.15 51.45,37.25 51.35,37.25 51.25,37.35 51.25,37.45 51.35,37.55 51.45,37.55 51.55,37.65 51.55,37.75 51.45,37.85 51.35,37.85 51.25,37.95 51.25,38.05 51.35,38.15 51.45,38.15 51.55,38.25 51.55,38.35 51.45,38.45 51.35,38.45 51.25,38.55 51.25,38.65 51.35,38.75 51.45,38.75 51.55,38.85 51.55,38.95 51.45,39.05 51.35,39.05 51.25,39.15 51.25,39.25 51.35,39.35 51.45,39.35 51.55,39.45 51.55,39.55 v51.4,39.7 51.4,40.15 51.25,40.3 X2.12
  Bottom 0.127: U8.15 v51.4,39.7 51.4,39.3 51.17,39.08 U7.4
HDMI_RX0_CLK_P  (via drill 0.2)
  Top 0.127: U2.B6 49.55,31.4 49.55,32.5 50.75,33.7 50.75,38.4 50.6,38.55 50.6,38.65 50.7,38.75 50.8,38.75 50.9,38.85 50.9,38.95 50.8,39.05 50.7,39.05 50.6,39.15 50.6,39.25 50.7,39.35 50.8,39.35 50.9,39.45 50.9,39.55 v50.75,39.7 50.75,40.05 50.25,40.55 X2.10
  Bottom 0.127: U8.16 v50.75,39.7 50.75,39.05 U7.3
HDMI_RX0_CTRL_EN  (via drill 0.2)
  Top 0.127: v48.15,47.5 48.4,47.75 52.5,47.75 v52.7,47.55 | U2.A9 53.5,32.95 53.5,37.3 55.5,39.3 55.5,44.2 v53.9,45.8
  Bottom 0.127: U8.5 v48.15,47.5 | v53.9,45.8 R28.2 52.73,46.55 U8.12 v52.7,47.55
HDMI_RX0_DATA0_N  (via drill 0.2)
  Top 0.127: U2.A5 49.15,32.75 50.1,33.7 50.1,36.6 49.95,36.75 49.95,36.85 50.05,36.95 50.15,36.95 50.25,37.05 50.25,37.15 50.15,37.25 50.05,37.25 49.95,37.35 49.95,37.45 50.05,37.55 50.15,37.55 50.25,37.65 50.25,37.75 50.15,37.85 50.05,37.85 49.95,37.95 49.95,38.05 50.05,38.15 50.15,38.15 50.25,38.25 50.25,38.35 50.15,38.45 50.05,38.45 49.95,38.55 49.95,38.65 50.05,38.75 50.15,38.75 50.25,38.85 50.25,38.95 50.15,39.05 50.05,39.05 49.95,39.15 49.95,39.25 50.05,39.35 50.15,39.35 50.25,39.45 50.25,39.55 v50.1,39.7 50.1,39.95 49.75,40.3 X2.9
  Bottom 0.127: U8.17 v50.1,39.7 50.1,39.05 U7.2
HDMI_RX0_DATA0_P  (via drill 0.2)
  Top 0.127: U2.C5 48.75,30.6 48.75,33 49.45,33.7 v49.45,39.7 49.45,39.85 48.75,40.55 X2.7
  Bottom 0.127: U8.18 v49.45,39.7 49.45,39.3 49.67,39.08 U7.1
HDMI_RX0_DATA1_N  (via drill 0.2)
  Top 0.127: U2.A4 48.35,33.5 48.15,33.7 48.15,36 48.3,36.15 48.3,36.25 48.2,36.35 48.1,36.35 48,36.45 48,36.55 48.1,36.65 48.2,36.65 48.3,36.75 48.3,36.85 48.2,36.95 48.1,36.95 48,37.05 48,37.15 48.1,37.25 48.2,37.25 48.3,37.35 48.3,37.45 48.2,37.55 48.1,37.55 48,37.65 48,37.75 48.1,37.85 48.2,37.85 48.3,37.95 48.3,38.05 48.2,38.15 48.1,38.15 48,38.25 48,38.35 48.1,38.45 48.2,38.45 48.3,38.55 48.3,38.65 48.2,38.75 48.1,38.75 48,38.85 48,38.95 48.1,39.05 48.2,39.05 48.3,39.15 48.3,39.25 48.2,39.35 48.1,39.35 48,39.45 48,39.55 v48.15,39.7 48.15,40.05 48.25,40.15 X2.6
  Bottom 0.127: U8.20 v48.15,39.7 48.15,39.3 47.92,39.08 U6.4
HDMI_RX0_DATA1_P  (via drill 0.2)
  Top 0.127: U2.B4 47.95,31.4 47.95,33.25 47.5,33.7 47.5,37.8 47.65,37.95 47.65,38.05 47.55,38.15 47.45,38.15 47.35,38.25 47.35,38.35 47.45,38.45 47.55,38.45 47.65,38.55 47.65,38.65 47.52,38.77 47.42,38.77 47.35,38.85 47.35,38.95 47.45,39.05 47.55,39.05 47.65,39.15 47.65,39.25 47.55,39.35 47.45,39.35 47.35,39.45 47.35,39.55 v47.5,39.7 47.5,40.15 47.25,40.4 X2.4
  Bottom 0.127: U8.21 v47.5,39.7 47.5,39.05 U6.3
HDMI_RX0_DATA2_N  (via drill 0.2)